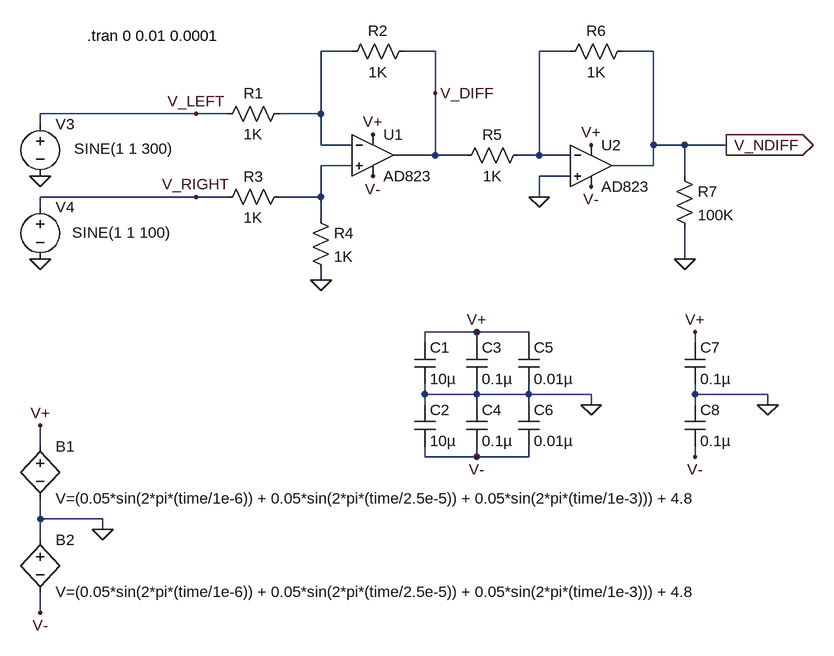
[diagram p0: schematic subtracter_noisy.asc]
subtracter_noisy.asc, the LTspice schematic file:
Version 4
SHEET 1 888 1096
WIRE 16 96 -32 96
WIRE 144 96 96 96
WIRE 352 96 304 96
WIRE 480 96 432 96
WIRE 144 160 144 96
WIRE -224 192 -464 192
WIRE -176 192 -224 192
WIRE -32 192 -32 96
WIRE -32 192 -96 192
WIRE -464 208 -464 192
WIRE -32 240 -32 192
WIRE 16 240 -32 240
WIRE 480 240 480 96
WIRE 528 240 480 240
WIRE 592 240 528 240
WIRE 144 256 144 160
WIRE 144 256 80 256
WIRE 192 256 144 256
WIRE 304 256 304 96
WIRE 304 256 272 256
WIRE 352 256 304 256
WIRE 16 272 -32 272
WIRE 480 272 480 240
WIRE 480 272 416 272
WIRE 352 288 304 288
WIRE 528 288 528 240
WIRE -224 320 -464 320
WIRE -176 320 -224 320
WIRE -32 320 -32 272
WIRE -32 320 -96 320
WIRE 304 320 304 288
WIRE -464 336 -464 320
WIRE -32 352 -32 320
WIRE 528 416 528 368
WIRE -32 448 -32 432
WIRE 208 528 128 528
WIRE 288 528 208 528
WIRE 128 544 128 528
WIRE 208 544 208 528
WIRE 288 544 288 528
WIRE 544 544 544 528
WIRE 128 624 128 608
WIRE 208 624 208 608
WIRE 208 624 128 624
WIRE 288 624 288 608
WIRE 288 624 208 624
WIRE 384 624 288 624
WIRE 544 624 544 608
WIRE 656 624 544 624
WIRE 128 640 128 624
WIRE 208 640 208 624
WIRE 288 640 288 624
WIRE 384 640 384 624
WIRE 544 640 544 624
WIRE 656 640 656 624
WIRE -464 704 -464 672
WIRE 128 720 128 704
WIRE 208 720 208 704
WIRE 208 720 128 720
WIRE 288 720 288 704
WIRE 288 720 208 720
WIRE 544 720 544 704
WIRE -464 816 -464 784
WIRE -368 816 -464 816
WIRE -368 832 -368 816
WIRE -464 848 -464 816
WIRE -464 960 -464 928
FLAG -368 832 0
FLAG -464 672 V+
FLAG 48 224 V+
FLAG -464 960 V-
FLAG 48 288 V-
FLAG 592 240 V_NDIFF
IOPIN 592 240 Out
FLAG -32 448 0
FLAG 384 240 V+
FLAG 384 304 V-
FLAG -464 288 0
FLAG -464 416 0
FLAG 304 320 0
FLAG 528 416 0
FLAG -224 192 V_LEFT
FLAG -224 320 V_RIGHT
FLAG 144 160 V_DIFF
FLAG 384 640 0
FLAG 656 640 0
FLAG 208 720 V-
FLAG 544 720 V-
FLAG 208 528 V+
FLAG 544 528 V+
SYMBOL res -80 176 R90
WINDOW 0 0 56 VBottom 2
WINDOW 3 32 56 VTop 2
SYMATTR InstName R1
SYMATTR Value 1K
SYMATTR SpiceLine tol=1 pwr=0.1
SYMBOL res 112 80 R90
WINDOW 0 0 56 VBottom 2
WINDOW 3 32 56 VTop 2
SYMATTR InstName R2
SYMATTR Value 1K
SYMBOL res -80 304 R90
WINDOW 0 0 56 VBottom 2
WINDOW 3 32 56 VTop 2
SYMATTR InstName R3
SYMATTR Value 1K
SYMBOL Opamps\\AD823 48 192 R0
SYMATTR InstName U1
SYMBOL res -48 336 R0
SYMATTR InstName R4
SYMATTR Value 1K
SYMBOL Opamps\\AD823 384 208 R0
SYMATTR InstName U2
SYMBOL res 288 240 R90
WINDOW 0 0 56 VBottom 2
WINDOW 3 32 56 VTop 2
SYMATTR InstName R5
SYMATTR Value 1K
SYMBOL res 448 80 R90
WINDOW 0 0 56 VBottom 2
WINDOW 3 32 56 VTop 2
SYMATTR InstName R6
SYMATTR Value 1K
SYMBOL voltage -464 192 R0
WINDOW 123 0 0 Left 0
WINDOW 39 0 0 Left 0
WINDOW 3 52 54 Left 2
SYMATTR Value SINE(1 1 300)
SYMATTR InstName V3
SYMBOL voltage -464 320 R0
WINDOW 123 0 0 Left 0
WINDOW 39 0 0 Left 0
WINDOW 3 49 55 Left 2
SYMATTR Value SINE(1 1 100)
SYMATTR InstName V4
SYMBOL res 512 272 R0
SYMATTR InstName R7
SYMATTR Value 100K
SYMBOL cap 112 544 R0
SYMATTR InstName C1
SYMATTR Value 10µ
SYMBOL cap 112 640 R0
SYMATTR InstName C2
SYMATTR Value 10µ
SYMBOL cap 192 544 R0
SYMATTR InstName C3
SYMATTR Value 0.1µ
SYMBOL cap 192 640 R0
SYMATTR InstName C4
SYMATTR Value 0.1µ
SYMBOL cap 272 544 R0
SYMATTR InstName C5
SYMATTR Value 0.01µ
SYMBOL cap 272 640 R0
SYMATTR InstName C6
SYMATTR Value 0.01µ
SYMBOL cap 528 544 R0
SYMATTR InstName C7
SYMATTR Value 0.1µ
SYMBOL cap 528 640 R0
SYMATTR InstName C8
SYMATTR Value 0.1µ
SYMBOL bv -464 688 R0
SYMATTR InstName B1
SYMATTR Value V=(0.05*sin(2*pi*(time/1e-6)) + 0.05*sin(2*pi*(time/2.5e-5)) + 0.05*sin(2*pi*(time/1e-3))) + 4.8
SYMBOL bv -464 832 R0
SYMATTR InstName B2
SYMATTR Value V=(0.05*sin(2*pi*(time/1e-6)) + 0.05*sin(2*pi*(time/2.5e-5)) + 0.05*sin(2*pi*(time/1e-3))) + 4.8
TEXT -392 72 Left 2 !.tran 0 0.01 0.0001

The netlist it stands for:
* subtracter_noisy.asc
R1 N001 V_LEFT 1K tol=1 pwr=0.1
R2 V_DIFF N001 1K
R3 N003 V_RIGHT 1K
XU1 N003 N001 V+ V- V_DIFF AD823  ; pins In+ In- V+ V- OUT
R4 N003 0 1K
XU2 0 N002 V+ V- V_NDIFF AD823  ; pins In+ In- V+ V- OUT
R5 N002 V_DIFF 1K
R6 V_NDIFF N002 1K
V3 V_LEFT 0 SINE(1 1 300)
V4 V_RIGHT 0 SINE(1 1 100)
R7 V_NDIFF 0 100K
C1 V+ 0 10µ
C2 0 V- 10µ
C3 V+ 0 0.1µ
C4 0 V- 0.1µ
C5 V+ 0 0.01µ
C6 0 V- 0.01µ
C7 V+ 0 0.1µ
C8 0 V- 0.1µ
B1 V+ 0 V=(0.05*sin(2*pi*(time/1e-6)) + 0.05*sin(2*pi*(time/2.5e-5)) + 0.05*sin(2*pi*(time/1e-3))) + 4.8
B2 0 V- V=(0.05*sin(2*pi*(time/1e-6)) + 0.05*sin(2*pi*(time/2.5e-5)) + 0.05*sin(2*pi*(time/1e-3))) + 4.8
.tran 0 0.01 0.0001
.lib ADI.lib
.backanno
.end